# EAGLE schematic Power (EAGLE 7.4.0)
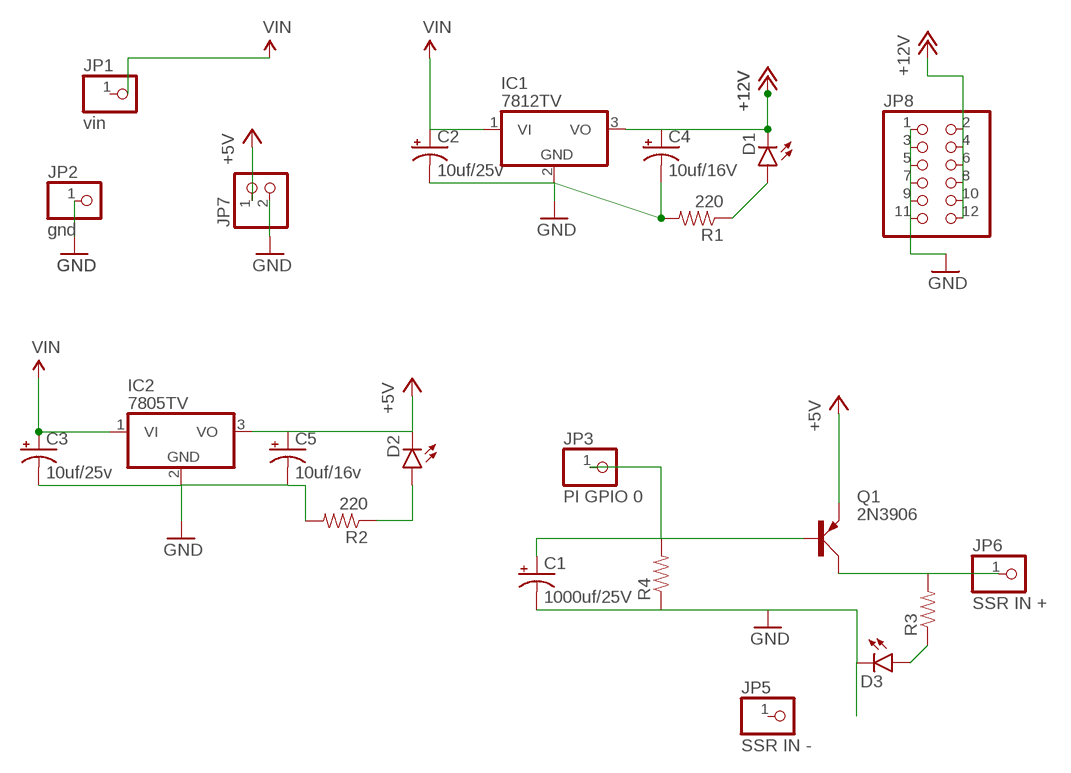
[diagram p0: schematic, sheet 1]

## Parts
C1  1000uf/25V  1000UF-25V(PTH)KIT  [CPOL-RADIAL-1000UF-25V-KIT]
C2  10uf/25v  CAP_POLPTH2  [CPOL-RADIAL-10UF-25V]
C3  10uf/25v  CAP_POLPTH2  [CPOL-RADIAL-10UF-25V]
C4  10uf/16V  CAP_POLPTH2  [CPOL-RADIAL-10UF-25V]
C5  10uf/16v  CAP_POLPTH2  [CPOL-RADIAL-10UF-25V]
D1  LED3MM  [LED3MM]
D2  LED3MM  [LED3MM]
D3  LED3MM  [LED3MM]
IC1  7812TV  [TO220V]
IC2  7805TV  [TO220V]
JP1  vin  PINHD-1X1  [1X01]
JP2  gnd  PINHD-1X1  [1X01]
JP3  PI GPIO 0  PINHD-1X1  [1X01]
JP5  SSR IN -  PINHD-1X1  [1X01]
JP6  SSR IN +  PINHD-1X1  [1X01]
JP7  PINHD-1X2  [1X02]
JP8  PINHD-2X6  [2X06]
Q1  2N3906  [TO92D]
R1  220  RESISTORPTH-1/4W  [AXIAL-0.4]
R2  220  RESISTORPTH-1/4W  [AXIAL-0.4]
R3  RESISTORPTH-1/4W  [AXIAL-0.4]
R4  RESISTORPTH-1/4W  [AXIAL-0.4]

## Nets
+5V: C5.1(+) D2.K(C) IC2.3(VO) JP7.1 Q1.E
+12V: C4.1(+) D1.K(C) IC1.3(VO) JP8.2 JP8.12
GND: C1.- C2.2(-) C3.2(-) C4.2(-) C5.2(-) D3.K(C) IC1.2(GND) IC2.2(GND) JP2.1 JP7.2 JP8.1 JP8.11 R1.P$2 R2.P$2 R4.P$1
N$1: D2.A R2.P$1
N$2: D1.A R1.P$1
N$3: C1.+ JP3.1 Q1.B R4.P$2
N$4: JP6.1 Q1.C R3.P$2
N$5: D3.A R3.P$1
V12V: C2.1(+) IC1.1(VI) ; supply symbol labelled VIN
VIN: C3.1(+) IC2.1(VI)
Unconnected: JP1.1 JP5.1 JP8.3 JP8.4 JP8.5 JP8.6 JP8.7 JP8.8 JP8.9 JP8.10

## Library data of the parts
C1 = SparkFun-Capacitors:1000UF-25V(PTH): CAP-08070; PROD_ID: CAP-09538
C2-C5 = SparkFun-Capacitors:CAP_POL: Capacitor Polarized These are standard SMD and PTH capacitors. Normally 10uF, 47uF, and 100uF in electrolytic and tantalum varieties. Always verify the external diameter of the through hole cap, it varies with capacity, voltage, and manufacturer. The EIA devices should be standard.
D1-D3 = SparkFun-LED:LED: LEDs Standard schematic elements and footprints for 5mm, 3mm, 1206, and 0603 sized LEDs. 5mm - Spark Fun Electronics SKU : COM-00529 (and others)
IC1 IC2 = linear:78*: Positive VOLTAGE REGULATOR Source: http://cache.national.com/ds/LM/LM78L05.pdf http://www.fairchildsemi.com/ds/LM/LM7805.pdf
JP1-JP3 JP5 JP6 = pinhead:PINHD-1X1: PIN HEADER
JP7 = pinhead:PINHD-1X2: PIN HEADER
JP8 = pinhead:PINHD-2X6: PIN HEADER
Q1 = transistor-small-signal:2N3906: PNP TRANSISTOR
R1-R4 = SparkFun-Resistors:RESISTOR: Resistor Basic schematic elements and footprints for 0603, 1206, and PTH resistors.